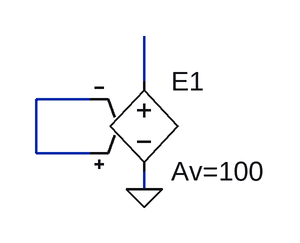
[diagram p0: schematic e2_test.asc]
e2_test.asc, the LTspice schematic file:
Version 4.1
SHEET 1 880 680
WIRE 512 304 512 264
WIRE 464 320 416 320
WIRE 416 368 416 320
WIRE 464 368 416 368
WIRE 512 400 512 384
FLAG 512 400 0
SYMBOL e2 512 288 R0
SYMATTR InstName E1
SYMATTR Value Av=100

The netlist it stands for:
* e2_test.asc
E1 N001 0 N002 N002 Av=100
.backanno
.end